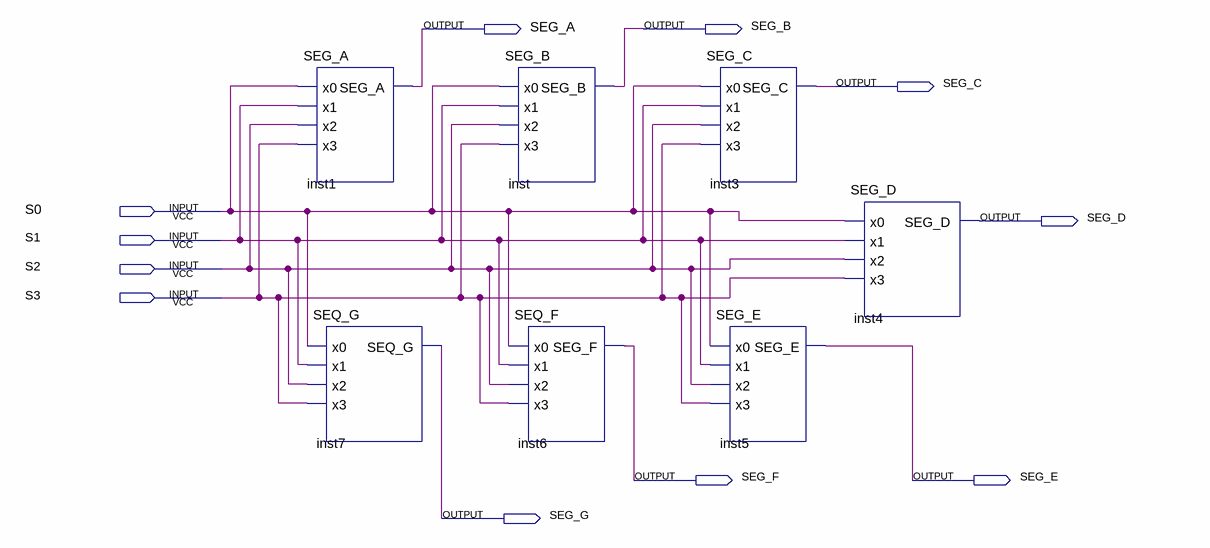
[diagram p0: schematic sheet]
// Quartus schematic TESTE7SEGDECODER.bdf as structural Verilog: 7 symbols, 11 pins
module TESTE7SEGDECODER (
  input  S0,
  input  S1,
  input  S2,
  input  S3,
  output SEG_A,
  output SEG_B,
  output SEG_C,
  output SEG_D,
  output SEG_F,
  output SEG_E,
  output SEG_G
);

  SEG_A inst1 (.x0(S0), .x1(S1), .x2(S2), .x3(S3), .SEG_A(SEG_A));
  SEQ_G inst7 (.x0(S0), .x1(S1), .x2(S2), .x3(S3), .SEQ_G(SEG_G));
  SEG_B inst (.x0(S0), .x1(S1), .x2(S2), .x3(S3), .SEG_B(SEG_B));
  SEQ_F inst6 (.x0(S0), .x1(S1), .x2(S2), .x3(S3), .SEG_F(SEG_F));
  SEG_C inst3 (.x0(S0), .x1(S1), .x2(S2), .x3(S3), .SEG_C(SEG_C));
  SEG_E inst5 (.x0(S0), .x1(S1), .x2(S2), .x3(S3), .SEG_E(SEG_E));
  SEG_D inst4 (.x0(S0), .x1(S1), .x2(S2), .x3(S3), .SEG_D(SEG_D));
endmodule
